# Altium schematic sheet LDO.SchDoc
size A; SheetNumber: 4; SheetTotal: 17
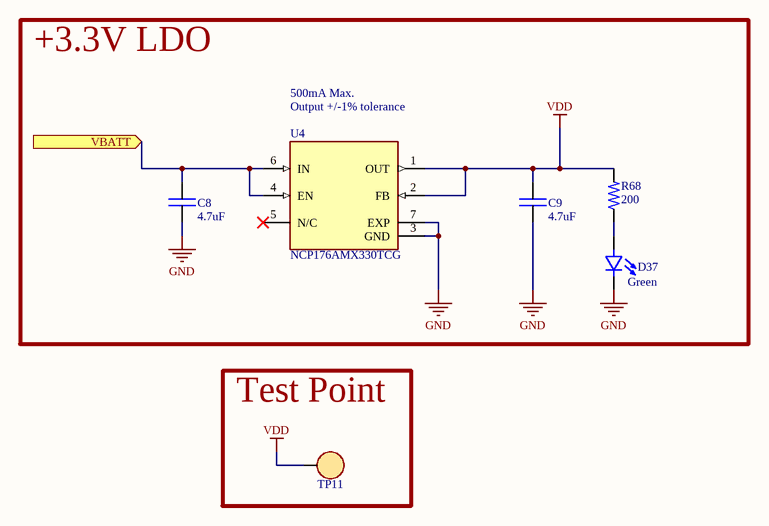
[diagram p0: LDO.SchDoc]

## Parts
C8  value 4.7uF  [0402C]  (hidden comment: CAP)
C9  value 4.7uF  [0402C]  (hidden comment: CAP)
D37  Color: Green  [0603-LED]  (hidden comment: LED - single)
R68  value 200  [0402R]  (hidden comment: RES)
TP11  RH-5019  [TP - RH-5019]  (value not drawn)
U4  NCP176AMX330TCG  [6-XDFN]

## Blocks framed on the sheet
+3.3V LDO: C8 C9 D37 R68 U4
Test Point: TP11

## Ports
VBATT (in, see PressurePulse_Brain-PCB_Master[4A], Fuel-Gauge[4B])

## Nets
GND: C8.1 C9.1 D37.2(C) U4.3(GND) U4.7(EXP)
VDD: C9.2 R68.2 TP11.1 U4.1(OUT) U4.2(FB)
VBATT: C8.2 U4.4(EN) U4.6(IN) ; port VBATT
NetD37_1: D37.1(A) R68.1

Not connected (* = marked no-connect by the designer): U4 5(N/C)*

## Notes on the sheet
- 500mA Max.
- Output +/-1% tolerance

## Library data of the parts
C8 C9 = CAP: Capacitor; MFR: *; MFR PN: *; JLCPCB PN: *; Footprint: *
D37 = LED - single: LED; Value: SZYY0603YG; MFR: *; MFR PN: *; JLCPCB PN: C434423
R68 = RES: Resistor; MFR PN: *; MFR: *; Type: SMD
TP11 = TEST POINT: MFR: ronghe; MFR PN: RH-5019; Value: RH-5019; JLCPCB PN: C5199800
U4 = LDO 3.3V: LDO REGULATOR; MFR: onsemi; MFR PN: NCP176AMX330TCG; Value: NCP176AMX330TCG; JLCPCB PN: C233363